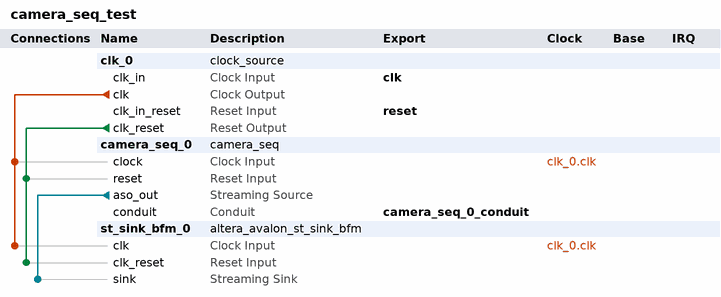
[diagram p0: system contents]
# Platform Designer (Qsys) system camera_seq_test, Cyclone IV GX EP4CGX150DF31C7
# Parameters at their usual value, and those the tool derives, are not listed.
package require -exact qsys 15.0
create_system camera_seq_test
set_project_property DEVICE_FAMILY {Cyclone IV GX}
set_project_property DEVICE EP4CGX150DF31C7

add_instance clk_0 clock_source 15.0
set_instance_parameter_value clk_0 clockFrequency 50000000

add_instance camera_seq_0 camera_seq 1.0
set_instance_parameter_value camera_seq_0 DATA_WIDTH 8
set_instance_parameter_value camera_seq_0 FIFO_LENGTH_LOG_2 8

add_instance st_sink_bfm_0 altera_avalon_st_sink_bfm 15.0
set_instance_parameter_value st_sink_bfm_0 ST_CHANNEL_W 1
set_instance_parameter_value st_sink_bfm_0 ST_ERROR_W 1
set_instance_parameter_value st_sink_bfm_0 ST_MAX_CHANNELS 1
set_instance_parameter_value st_sink_bfm_0 ST_NUMSYMBOLS 1
set_instance_parameter_value st_sink_bfm_0 ST_READY_LATENCY 1
set_instance_parameter_value st_sink_bfm_0 ST_SYMBOL_W 8
set_instance_parameter_value st_sink_bfm_0 USE_CHANNEL 0
set_instance_parameter_value st_sink_bfm_0 USE_EMPTY 0
set_instance_parameter_value st_sink_bfm_0 USE_ERROR 0
set_instance_parameter_value st_sink_bfm_0 USE_PACKET 1
set_instance_parameter_value st_sink_bfm_0 USE_READY 1
set_instance_parameter_value st_sink_bfm_0 USE_VALID 1
set_instance_parameter_value st_sink_bfm_0 VHDL_ID 0

# connections
add_connection clk_0.clk camera_seq_0.clock clock
add_connection clk_0.clk st_sink_bfm_0.clk clock
add_connection clk_0.clk_reset camera_seq_0.reset reset
add_connection clk_0.clk_reset st_sink_bfm_0.clk_reset reset
add_connection camera_seq_0.aso_out st_sink_bfm_0.sink avalon_streaming

# exported interfaces
add_interface camera_seq_0_conduit conduit end
set_interface_property camera_seq_0_conduit EXPORT_OF camera_seq_0.conduit
add_interface clk clock sink
set_interface_property clk EXPORT_OF clk_0.clk_in
add_interface reset reset sink
set_interface_property reset EXPORT_OF clk_0.clk_in_reset

set_interconnect_requirement {$system} qsys_mm.clockCrossingAdapter HANDSHAKE
set_interconnect_requirement {$system} qsys_mm.enableEccProtection FALSE
set_interconnect_requirement {$system} qsys_mm.insertDefaultSlave FALSE
set_interconnect_requirement {$system} qsys_mm.maxAdditionalLatency 1

save_system camera_seq_test.qsys
